# Altium project 懒人关灯之_ZigBee终端电路.PrjPCB
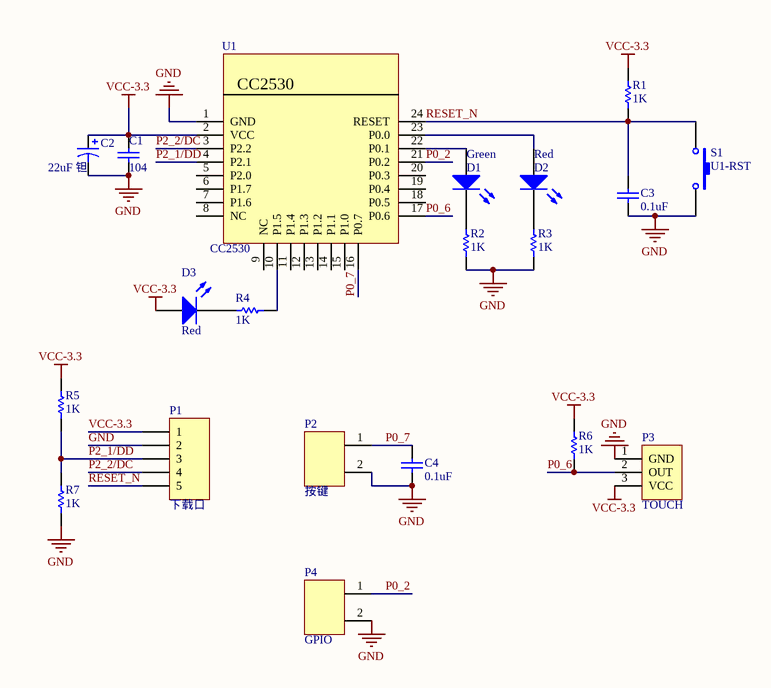
[diagram p0: 懒人关灯之_ZigBee终端电路.SchDoc]
1 sheet, 20 parts. Net scope: global (net labels, ports and power ports of the same name join across sheets).
Board file: 懒人关灯之_ZigBee终端电路.PcbDoc

## Sheet 懒人关灯之_ZigBee终端电路.SchDoc
size A4

### Parts
C1  value 104  [0603]  (hidden comment: Cap)
C2  value 22uF 钽  [CT2335-1210]  (hidden comment: Cap Pol1)
C3  value 0.1uF  [0603]  (hidden comment: Cap)
C4  value 0.1uF  [0603]  (hidden comment: Cap)
D1  Green  [0603-led]
D2  Red  [0603-led]
D3  Red  [0603-led]
P1  下载口  [5-PIN - zhen]
P2  按键  [2-pin - duanzi - 3.81]
P3  TOUCH  [3PIN-TOUCH]
P4  GPIO  [2-pin]
R1  value 1K  [0603]  (hidden comment: Res1)
R2  value 1K  [0603]  (hidden comment: Res1)
R3  value 1K  [0603]  (hidden comment: Res1)
R4  value 1K  [0603]  (hidden comment: Res1)
R5  value 1K  [0603]  (hidden comment: Res1)
R6  value 1K  [0603]  (hidden comment: Res1)
R7  value 1K  [0603]  (hidden comment: Res1)
S1  U1-RST  [K2-1806SA]
U1  CC2530  [ZIGBEE-E18-MS1-PCB]

### Nets
GND: C1.1 C2.2 C3.2 C4.2 P1.2 P2.2 P3.1(GND) P4.2 R2.2 R3.2 R7.2 S1.2 U1.1(GND)
VCC-3.3: C1.2 C2.1 D3.1(A) P1.1 P3.3(VCC) R1.1 R5.1 R6.1 U1.2(VCC)
P0_2: P4.1 U1.21(P0.2)
P0_6: P3.2(OUT) R6.2 U1.17(P0.6)
P0_7: C4.1 P2.1 U1.16(P0.7)
P2_1/DD: P1.3 R5.2 R7.1 U1.4(P2.1)
P2_2/DC: P1.4 U1.3(P2.2)
RESET_N: C3.1 P1.5 R1.2 S1.1 U1.24(RESET)
NetD1_1: D1.1(A) U1.22(P0.1)
NetD1_2: D1.2(K) R2.1
NetD2_1: D2.1(A) U1.23(P0.0)
NetD2_2: D2.2(K) R3.1
NetD3_2: D3.2(K) R4.1
NetR4_2: R4.2 U1.10(P1.5)

Not connected (* = marked no-connect by the designer): U1 5(P2.0) 6(P1.7) 7(P1.6) 8(NC) 9(NC) 11(P1.4) 12(P1.3) 13(P1.2) 14(P1.1) 15(P1.0) 18(P0.5) 19(P0.4) 20(P0.3)

### Library data of the parts
C1 C3 C4 = Cap: Capacitor; Published: 8-Jun-2000; LatestRevisionDate: 17-Jul-2002; LatestRevisionNote: Re-released for DXP Platform.; PackageReference: RAD-0.3; Publisher: Altium Limited; PackageDescription: Radial Cap, Thru-Hole; 2 Leads; 0.3 in Pin Spacing
C2 = Cap Pol1: Polarized Capacitor (Radial); Published: 8-Jun-2000; LatestRevisionDate: 17-Jul-2002; LatestRevisionNote: Re-released for DXP Platform.; PackageReference: RB7.6-15; Publisher: Altium Limited; PackageDescription: Polarized Capacitor (Radial); 2 Leads
D1-D3 = LED0: Typical INFRARED GaAs LED; Published: 8-Jun-2000; LatestRevisionDate: 08-Jul-2005; LatestRevisionNote: Mech Layer 1 removed.; PackageReference: LED-0; Publisher: Altium Limited; PackageDescription: LED; 2 Leads
P1 = Header 5: Header, 5-Pin; LatestRevisionDate: 17-Jul-2002; LatestRevisionNote: Re-released for DXP Platform.; Publisher: Altium Limited
P2 P4 = 2PIN
R1-R7 = Res1: Resistor; Published: 8-Jun-2000; LatestRevisionDate: 17-Jul-2002; LatestRevisionNote: Re-released for DXP Platform.; PackageReference: AXIAL-0.3; Publisher: Altium Limited; PackageDescription: Axial Device, Thru-Hole; 2 Leads; 0.3 in Pin Spacing
S1 = SW-PB: Switch; Published: 24-Mar-1999; LatestRevisionDate: 17-Jul-2002; LatestRevisionNote: Re-released for DXP Platform.; PackageReference: SPST-2; Publisher: Altium Limited; PackageDescription: Switch; 2 Leads